# EAGLE board EEZ DIB DCM224 r3B3 (EAGLE 7.2.0), part 1 of 2
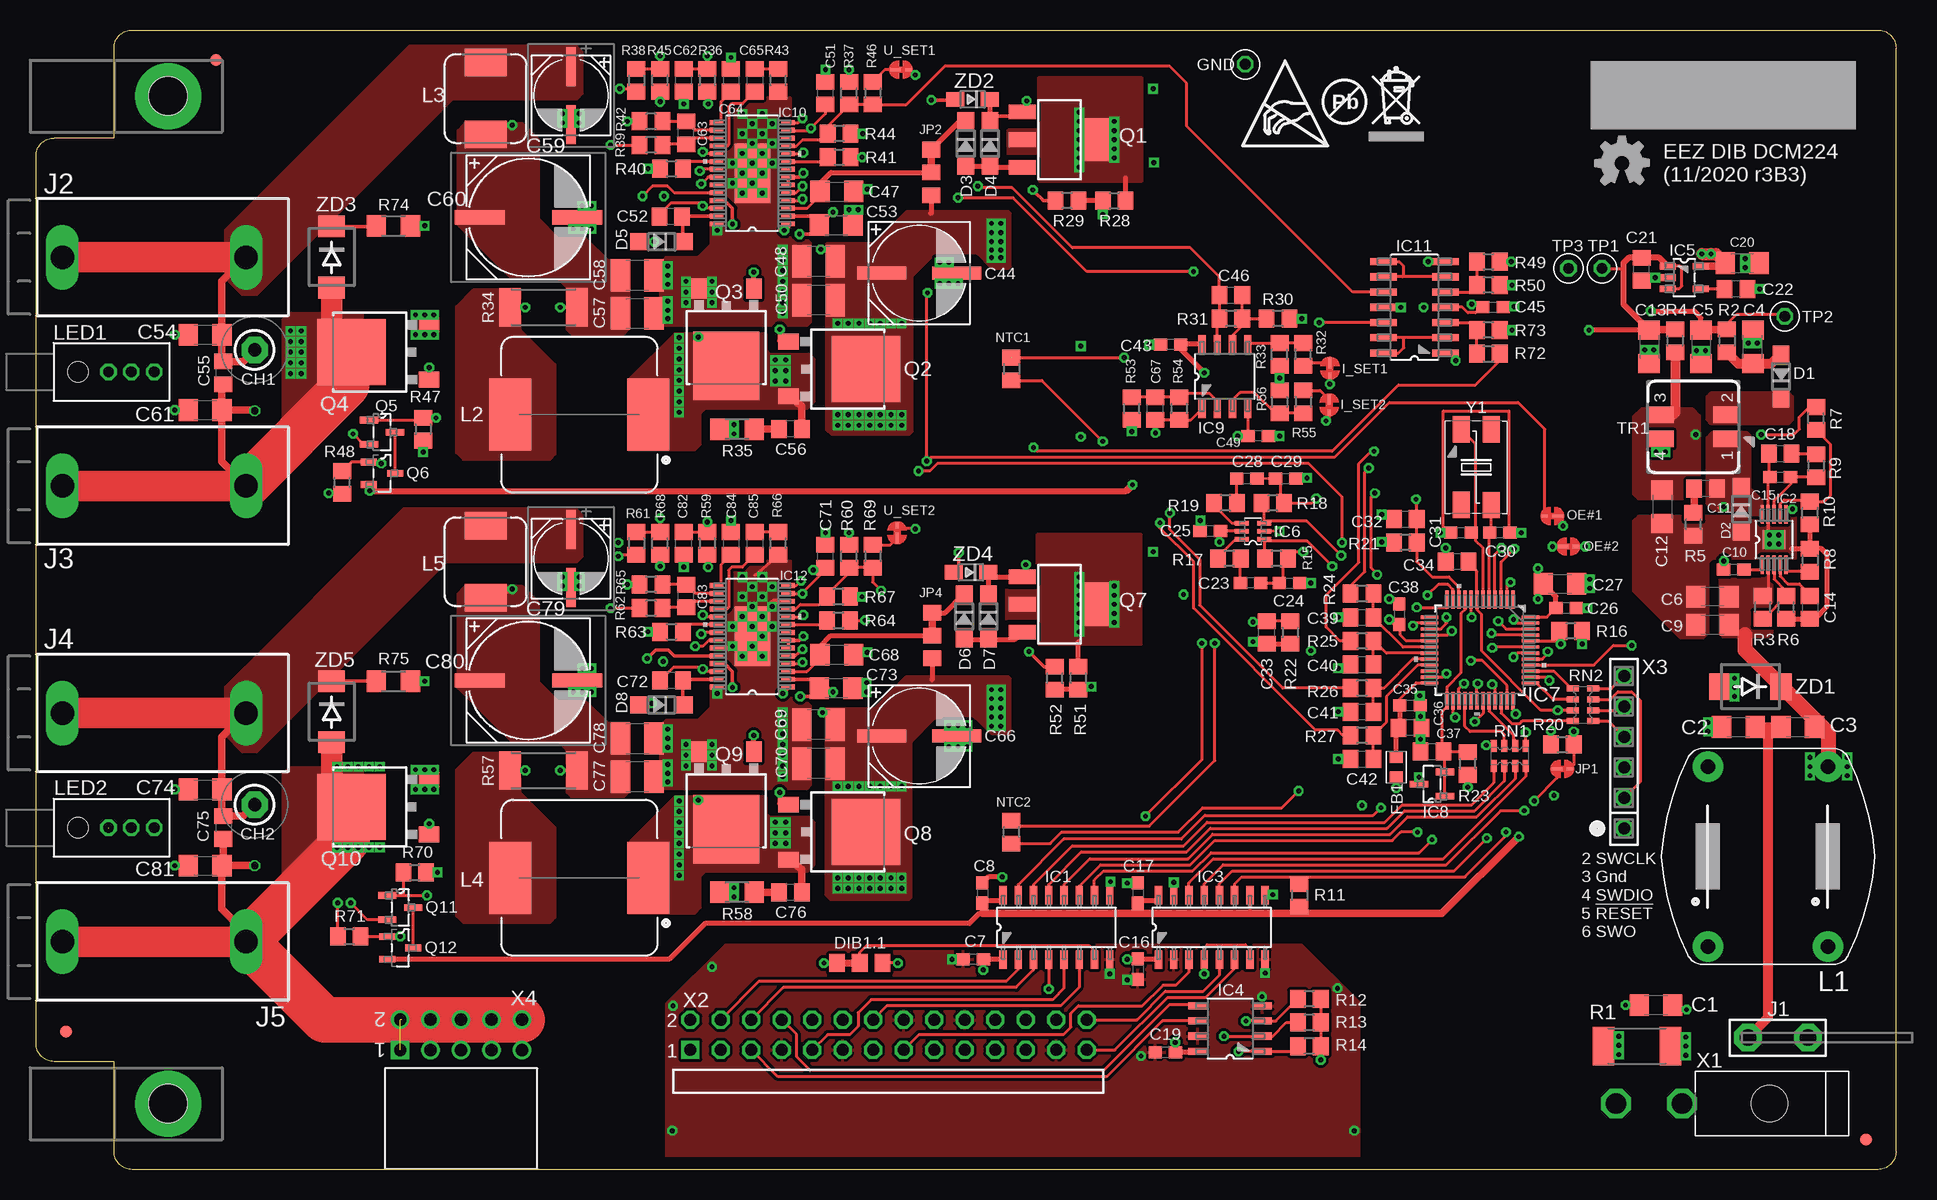
[diagram p4: board, top side]
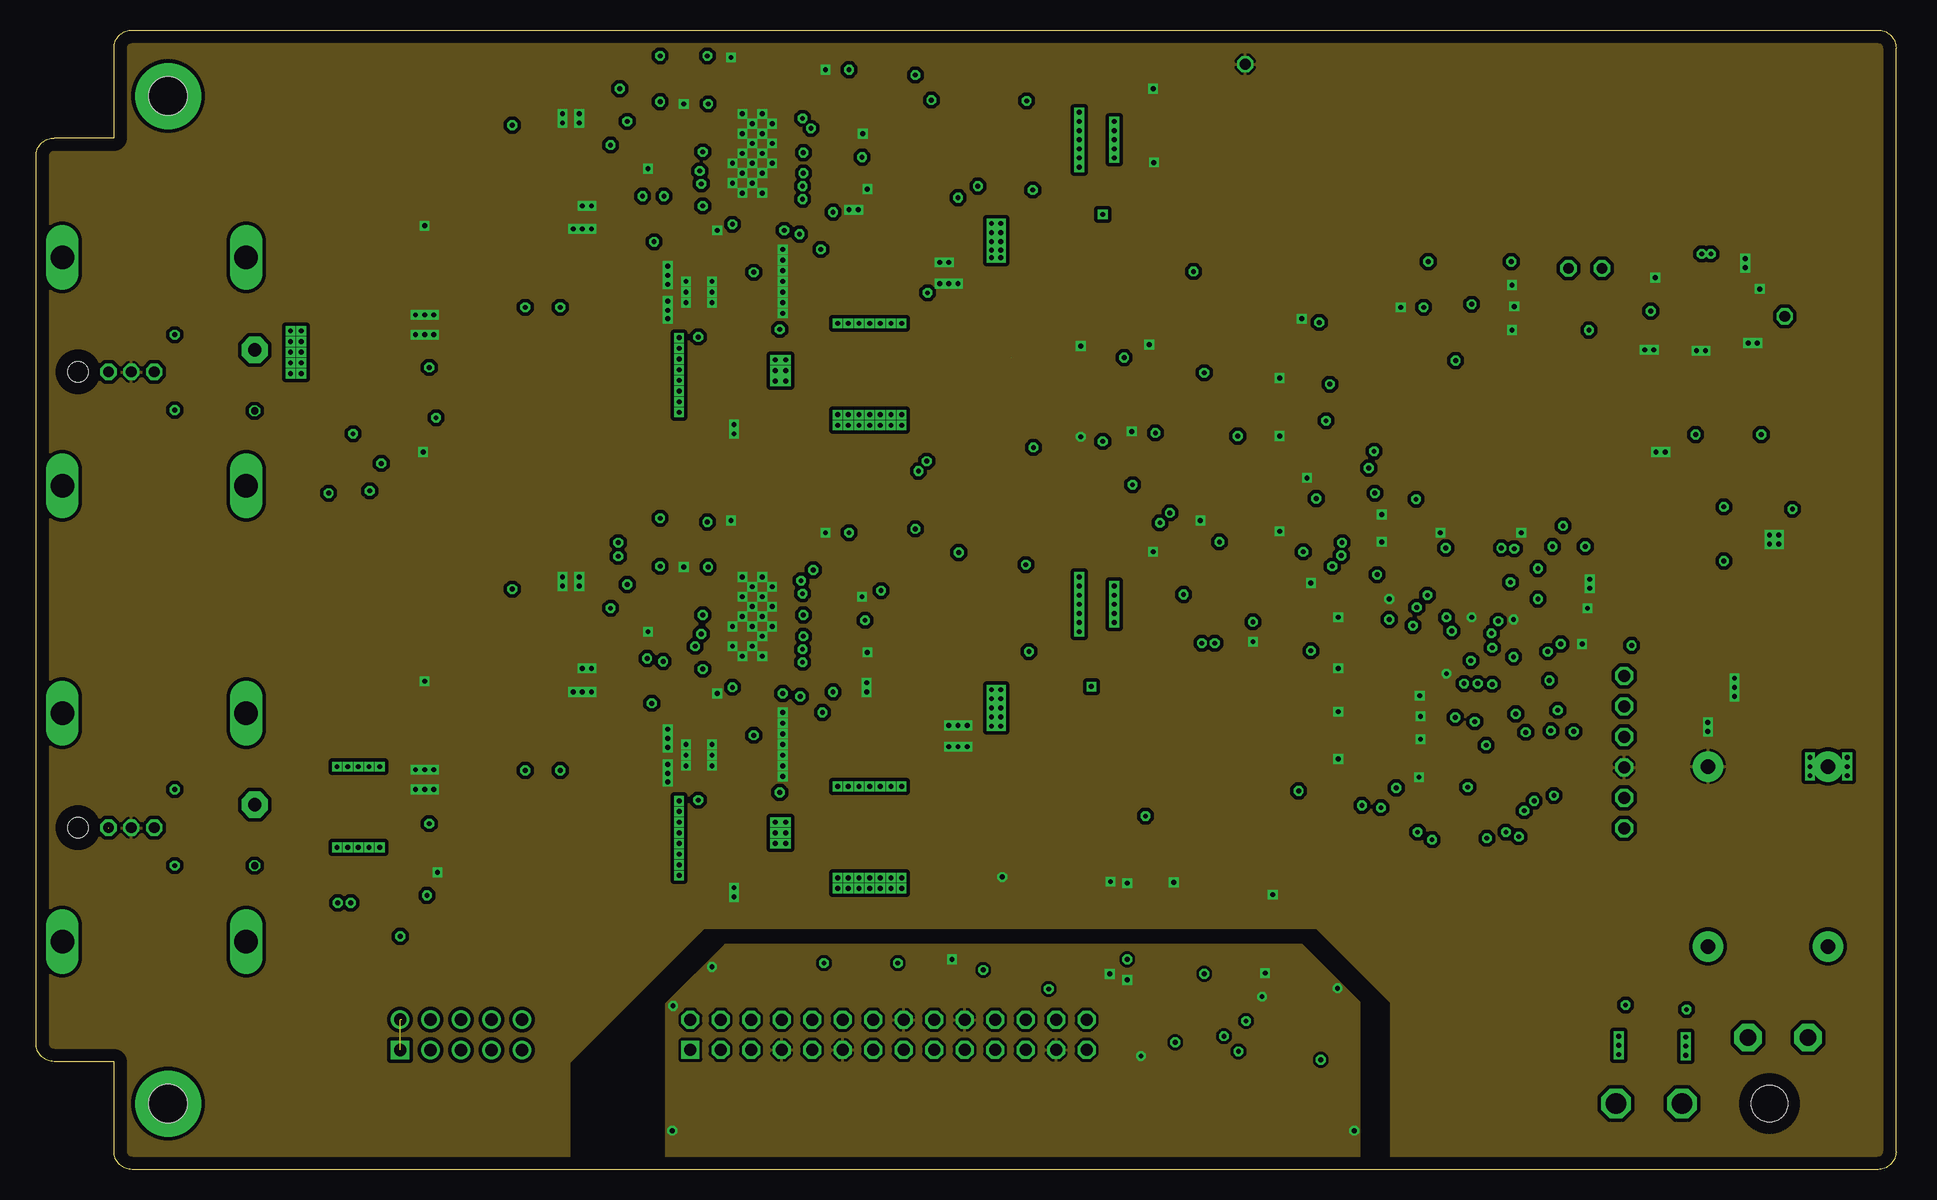
[diagram p5: board, inner layer L2]
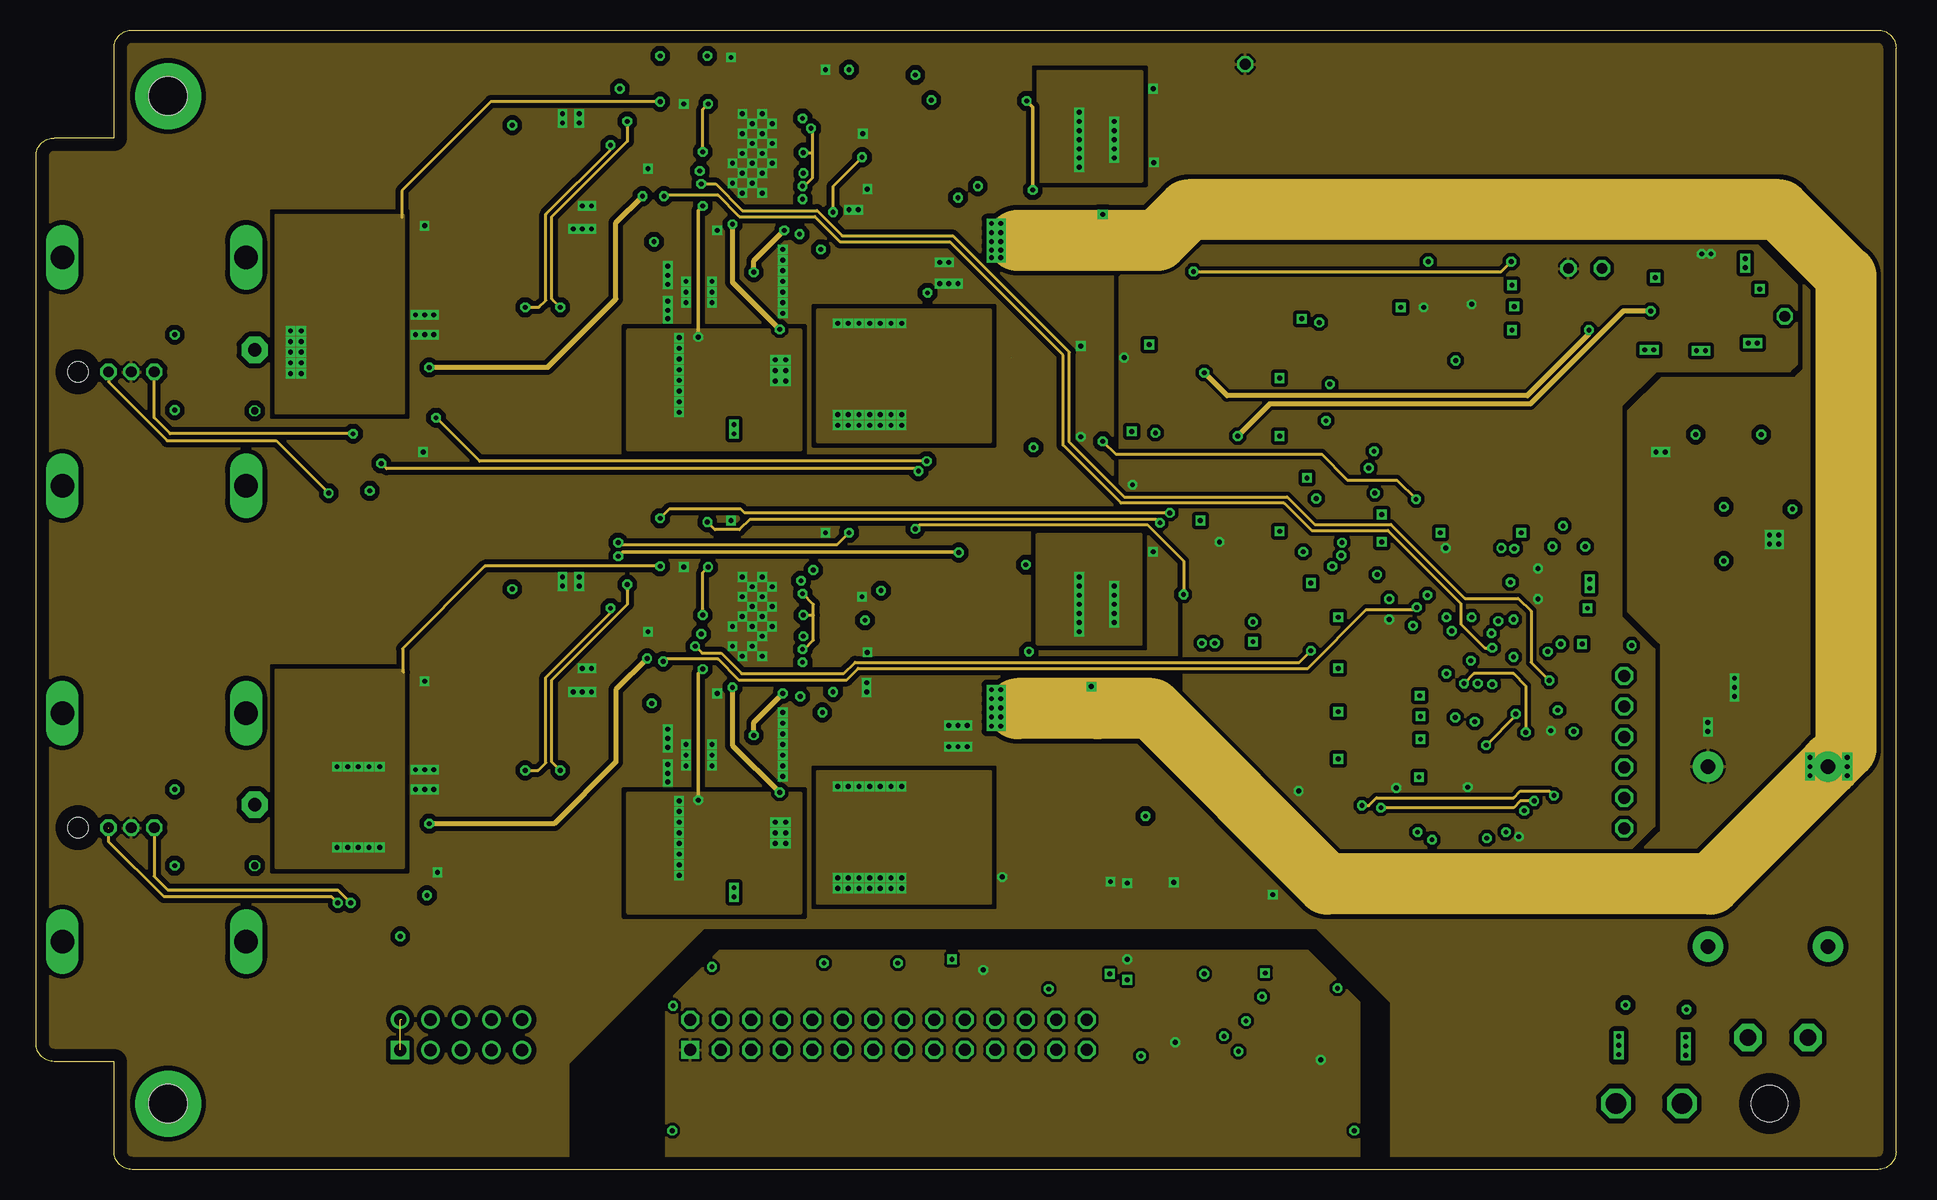
[diagram p6: board, inner layer L3]
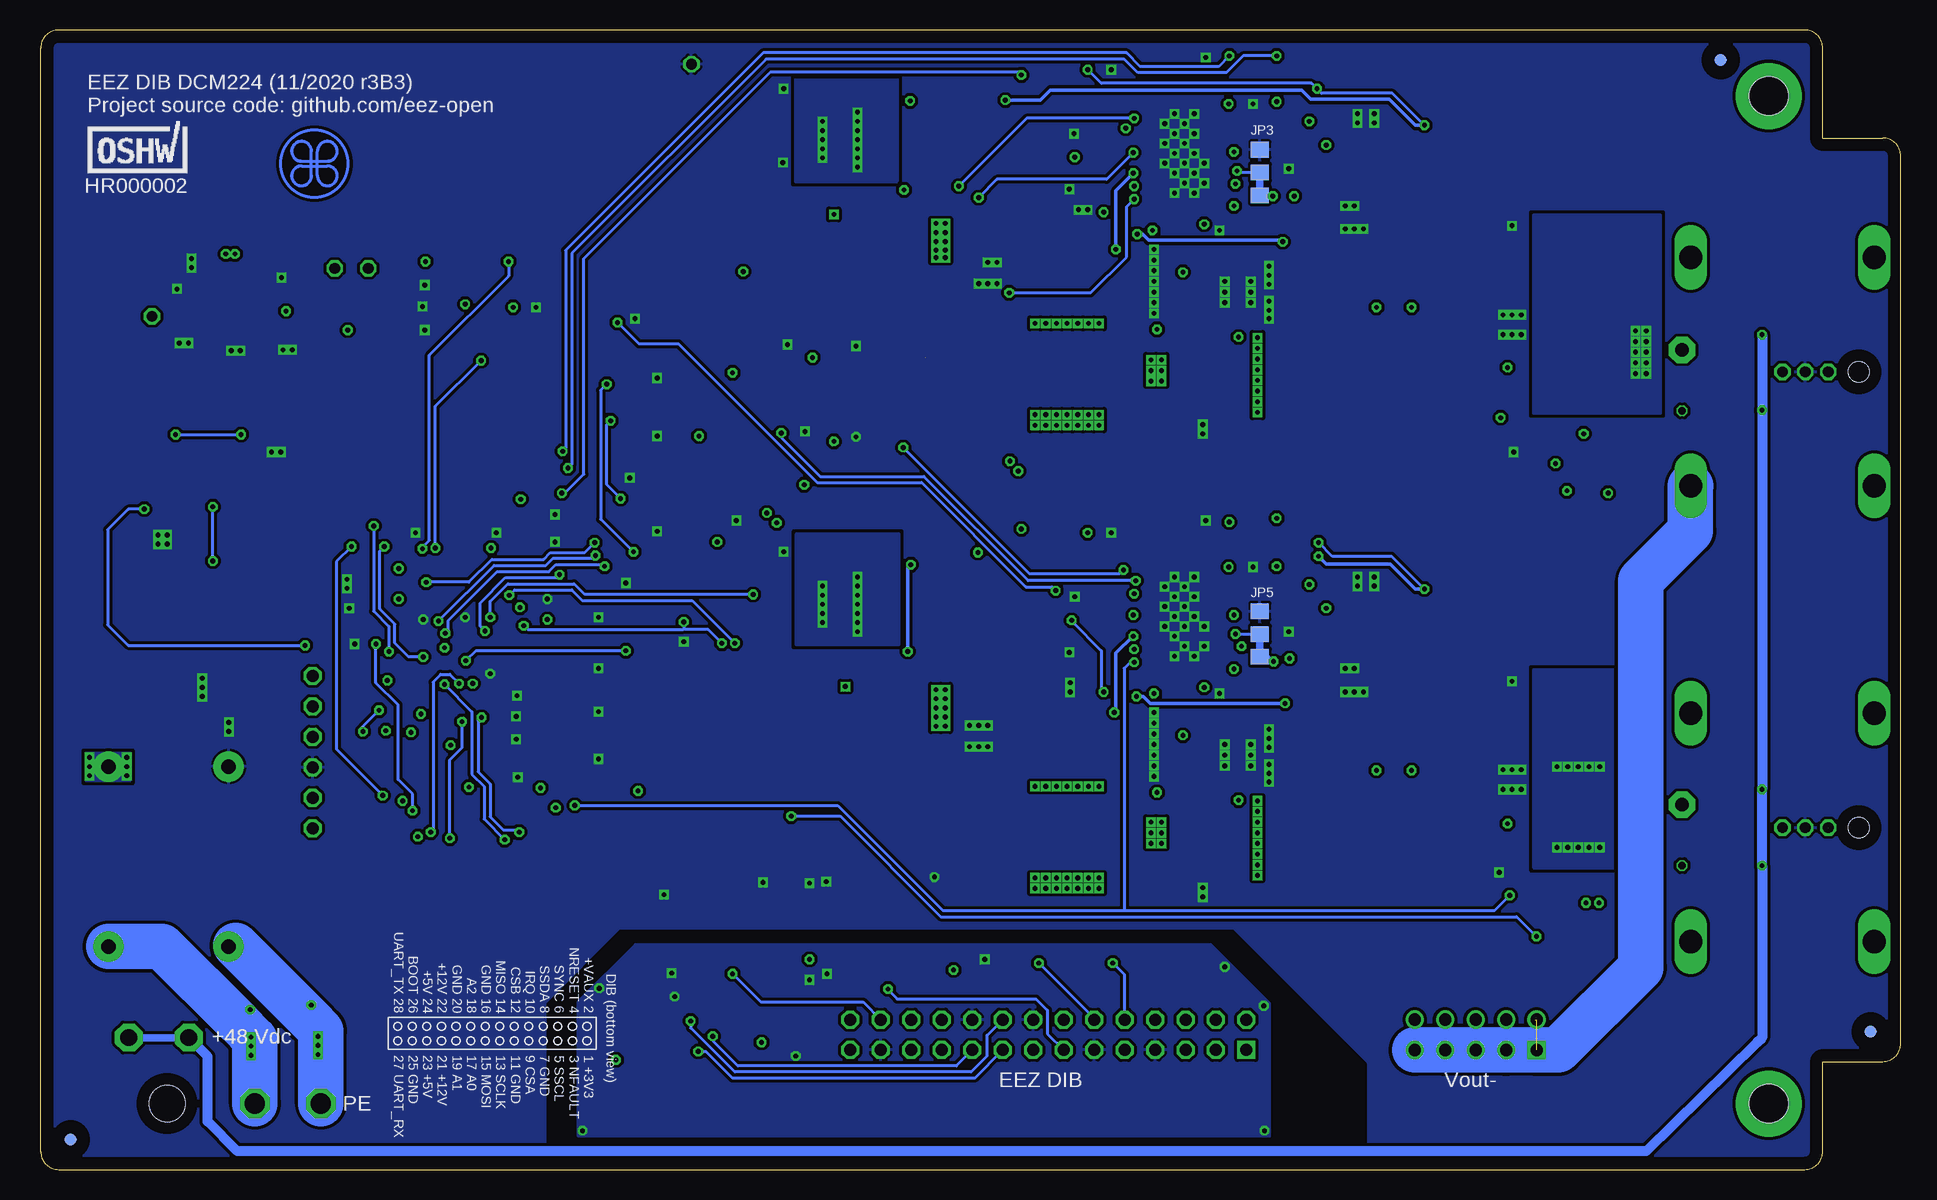
[diagram p7: board, bottom side, seen from below]

Size 155 x 95 mm. Coordinates in mm from the lower left corner, seen from the top.
Outline: 8,95 153.5,95 arc-90 155,93.5 155,1.5 arc-90 153.5,0 8,0 arc-90 6.5,1.5 6.5,9 1.5,9 arc-90 0,10.5 0,84.5 arc-90 1.5,86 6.5,86 6.5,93.5 arc-90 8,95
Copper layers (1+2+15+16): Top 0.035mm / dielectric 7mil / L2 0.03mm / dielectric 44mil / L3 0.03mm / dielectric 7mil / Bottom 0.035mm
Design rules "default *": minimum track width 6mil, minimum drill 0.3mm, track to track 6mil, track to pad 6mil, pad to pad 6mil, via to via 6mil, smd to smd 6mil, copper to edge 40mil, drill to drill 8mil, minimum pad ring 4mil, minimum via ring 8mil, stop-mask expansion 2.5mil, vias tented up to drill 1mm, thermal gap 8mil
Net classes: 0 default: width 0.203 mm, drill 0.3 mm, clearance 0.203 mm; 1 lvds: width 0.152 mm, drill 0.3 mm, clearance 0.152 mm to class 0, clearance 0.152 mm; 2 gnd: width 0.254 mm, drill 0.584 mm, clearance 0.254 mm
vRestrict: area 0,0 to 42,14; area 53,0 to 128,8.5

## Footprints (pad centres in the part's own frame; a part is rotated, then mirrored left to right if it is on the bottom)
C1206 = smd 1.6 x 1.8: 1 -1.4,0; 2 1.4,0
C0603 = smd 1.1 x 1: 1 -0.85,0; 2 0.85,0
C0805 = smd 1.3 x 1.5: 1 -0.95,0; 2 0.95,0
CAPAE830X1050N = smd 4.064 x 1.092: + -3.124,0; - 3.124,0
C1210 = smd 1.6 x 2.7: 1 -1.4,0; 2 1.4,0
CAPAE660X610N = smd 3.251 x 0.762: 1 -2.413,0; 2 2.413,0
CAPAE1030X1050N = smd 4.166 x 1.194: + -4.064,0; - 4.064,0
TP_1.1MM_2 = drill 0.6 octagon: GND 5.08,0 | drill 1.1 pad 2.184 octagon: TIP 0,0
SOD123 = smd 1.4 x 1.4: A 1.9,0; C -1.9,0
JP3-0805-CUT2 = smd 1.3 x 1.5: COM 0,0; NC 1.9,0; NO -1.9,0
BEAD0603 = smd 1 x 1.1: P$1 -0.85,0; P$2 0.85,0
FIDUCIAL_DUAL = smd 1.016 x 1.016 bottom: B 0,0 | smd 1.016 x 1.016: T 0,0
TEST-PIN_0.9MM = drill 0.9 octagon: 1 0,0
JP2-NOCUT = smd 0.889 x 0.254: 1 -0.445,0 | smd 0.508 x 0.254: 2 0.635,0
SOIC-16 = smd 1.549 x 0.61: 1 -2.692,4.445; 2 -2.692,3.175; 3 -2.692,1.905; 4 -2.692,0.635; 5 -2.692,-0.635; 6 -2.692,-1.905; 7 -2.692,-3.175; 8 -2.692,-4.445; 9 2.692,-4.445; 10 2.692,-3.175; 11 2.692,-1.905; 12 2.692,-0.635; 13 2.692,0.635; 14 2.692,1.905; 15 2.692,3.175; 16 2.692,4.445
SOP50P490X110-11N = smd 1.549 x 0.279: 1 -2.108,0.991; 2 -2.108,0.508; 3 -2.108,0; 4 -2.108,-0.508; 5 -2.108,-0.991; 6 2.108,-0.991; 7 2.108,-0.508; 8 2.108,0; 9 2.108,0.508; 10 2.108,0.991 | smd 1.575 x 1.88: TP 0,0
SOIC127P600X173-8N = smd 1.55 x 0.6: 1 -2.7,1.9; 2 -2.7,0.63; 3 -2.7,-0.64; 4 -2.7,-1.91; 5 2.7,-1.91; 6 2.7,-0.64; 7 2.7,0.63; 8 2.7,1.9
SOT95P270X145-5N = smd 1.321 x 0.559: 1 -1.372,0.94; 2 -1.372,0; 3 -1.372,-0.94; 4 1.372,-0.94; 5 1.372,0.94
SOT65P210X110-6N = smd 1.168 x 0.356: 1 -0.94,0.66; 2 -0.94,0; 3 -0.94,-0.66; 4 0.94,-0.66; 5 0.94,0; 6 0.94,0.66
LQFP-48 = smd 1.473 x 0.279: 1 -4.216,2.743; 2 -4.216,2.261; 3 -4.216,1.753; 4 -4.216,1.245; 5 -4.216,0.762; 6 -4.216,0.254; 7 -4.216,-0.254; 8 -4.216,-0.762; 9 -4.216,-1.245; 10 -4.216,-1.753; 11 -4.216,-2.261; 12 -4.216,-2.743; 25 4.216,-2.743; 26 4.216,-2.261; 27 4.216,-1.753; 28 4.216,-1.245; 29 4.216,-0.762; 30 4.216,-0.254; 31 4.216,0.254; 32 4.216,0.762; 33 4.216,1.245; 34 4.216,1.753; 35 4.216,2.261; 36 4.216,2.743 | smd 0.279 x 1.473: 13 -2.743,-4.216; 14 -2.261,-4.216; 15 -1.753,-4.216; 16 -1.245,-4.216; 17 -0.762,-4.216; 18 -0.254,-4.216; 19 0.254,-4.216; 20 0.762,-4.216; 21 1.245,-4.216; 22 1.753,-4.216; 23 2.261,-4.216; 24 2.743,-4.216; 37 2.743,4.216; 38 2.261,4.216; 39 1.753,4.216; 40 1.245,4.216; 41 0.762,4.216; 42 0.254,4.216; 43 -0.254,4.216; 44 -0.762,4.216; 45 -1.245,4.216; 46 -1.753,4.216; 47 -2.261,4.216; 48 -2.743,4.216
SOT103P240X110-3N = smd 1.524 x 0.559: 1 -1.079,1.016; 2 -1.079,-1.016; 3 1.079,0
LTC_05-08-1663-EB = smd 1.118 x 0.406: 1 -2.975,4.225; 2 -2.975,3.575; 3 -2.975,2.925; 4 -2.975,2.275; 5 -2.975,1.625; 6 -2.975,0.975; 7 -2.975,0.325; 8 -2.975,-0.325; 9 -2.975,-0.975; 10 -2.975,-1.625; 11 -2.975,-2.275; 12 -2.975,-2.925; 13 -2.975,-3.575; 14 -2.975,-4.225; 15 2.975,-4.225; 16 2.975,-3.575; 17 2.975,-2.925; 18 2.975,-2.275; 19 2.975,-1.625; 20 2.975,-0.975; 21 2.975,-0.325; 22 2.975,0.325; 23 2.975,0.975; 24 2.975,1.625; 25 2.975,2.275; 26 2.975,2.925; 27 2.975,3.575; 28 2.975,4.225 | smd 2.95 x 4.95: TP 0,0
SOIC127P600X175-14N = smd 2.2 x 0.6: 1 -2.591,3.81; 2 -2.591,2.54; 3 -2.591,1.27; 4 -2.591,0; 5 -2.591,-1.27; 6 -2.591,-2.54; 7 -2.591,-3.81; 8 2.591,-3.81; 9 2.591,-2.54; 10 2.591,-1.27; 11 2.591,0; 12 2.591,1.27; 13 2.591,2.54; 14 2.591,3.81
PCB_TAB-4907 = drill 1.4 pad 2.3 octagon: 1 -2.5,0; 2 2.5,0
DELTRON_571 = drill 1.94 long: 1 0,0; 1.1 15.3,0
PCB-MB = hole 3.2: 0,0
RN112 = drill 1.2 pad 2.54: 1 -7.5,5; 2 7.5,5; 3 -7.5,-5; 4 7.5,-5
125CDMCC/DS = smd 3.5 x 6: 1 -5.75,0; 2 5.75,0
COILCRAFT_HPI0630 = smd 2.3 x 3.5: 1 -3,0; 2 3,0
L-42WUM-1EGWT = drill 0.9 octagon: CC 4.445,0; GREEN 6.35,0; RED 2.54,0 | hole 1.7: 0,0
R_0805 = smd 1.3 x 1.5: 1 -0.95,0; 2 0.95,0
SOT223 = smd 1.219 x 2.235: 1 -2.311,-3.099; 2 0,-3.099; 3 2.311,-3.099 | smd 3.6 x 2.2: 4 0,3.099
TO252 = smd 1.3 x 1.7: 1 -2.285,-5.49; 2 2.285,-5.49 | smd 5.5 x 5.7: 3 0,0.95
SOT95P237X112-3N = smd 1.321 x 0.559: 1 -1.092,0.94; 2 -1.092,-0.94; 3 1.092,0
R2512 = smd 1.8 x 3.2: 1 -2.8,0; 2 2.8,0
R0805 = smd 1.3 x 1.5: 1 -0.95,0; 2 0.95,0
R_2512-4WIRE = smd 1.8 x 3.2: 1 -2.8,0; 2 2.8,0 | smd 1.27 x 0.254: 1S -2.413,0; 2S 2.413,0
R1206 = smd 1.6 x 1.803: 1 -1.422,0; 2 1.422,0
CAY16 = smd 0.5 x 1: 1 -1.35,-0.85; 2 -0.45,-0.85; 3 0.45,-0.85; 4 1.35,-0.85; 5 1.35,0.85; 6 0.45,0.85; 7 -0.45,0.85; 8 -1.35,0.85
SHORT_NOHOLE = smd 0.5 x 0.25 bottom: 1 0,0.117; 2 0,-0.117
SRF0703 = smd 1.4 x 2.1: 1 1,2.7; 2 -1,2.7; 3 -1,-2.7; 4 1,-2.7
MINIFIT_39301020 = drill 1.7 octagon: 1 0,0; 2 0,5.5 | hole 3: 0,-7.3
77317-104-28LF = drill 1 pad 1.5 square: 1 -33.02,-2.54 | drill 1 pad 1.5 octagon: 2 -33.02,0; 3 -30.48,-2.54; 4 -30.48,0; 5 -27.94,-2.54; 6 -27.94,0; 7 -25.4,-2.54; 8 -25.4,0; 9 -22.86,-2.54; 10 -22.86,0; 11 -20.32,-2.54; 12 -20.32,0; 13 -17.78,-2.54; 14 -17.78,0; 15 -15.24,-2.54; 16 -15.24,0; 17 -12.7,-2.54; 18 -12.7,0; 19 -10.16,-2.54; 20 -10.16,0; 21 -7.62,-2.54; 22 -7.62,0; 23 -5.08,-2.54; 24 -5.08,0; 25 -2.54,-2.54; 26 -2.54,0; 27 0,-2.54; 28 0,0
SSW-106-02-S-S = drill 1 pad 1.5 octagon: 1 -6.35,0; 2 -3.81,0; 3 -1.27,0; 4 1.27,0; 5 3.81,0; 6 6.35,0
SSW-105-02-T-D-RA = drill 1.016 square: 1 10.16,2.54 | drill 1.016: 2 10.16,0; 3 7.62,2.54; 4 7.62,0; 5 5.08,2.54; 6 5.08,0; 7 2.54,2.54; 8 2.54,0; 9 0,2.54; 10 0,0
12SMX(B) = smd 2.2 x 1.4: 1 -3.15,-1.25; 2 3.14,-1.25; 3 3.15,1.25; 4 -3.15,1.25
DO214AA = smd 1.8 x 2.2: A 2.55,0; C -2.55,0
SOD323-W = smd 1.5 x 1.2: A 1.45,0; C -1.45,0

## Placement (x,y rotation side)
C1  1u/100V  [C1206]  135,13.72 0 top
C2  10n/200V  [C1206]  141.86,36.89 0 top
C3  10n/200V  [C1206]  146.81,36.89 0 top
C4  4u7  [C1206]  143.07,68.58 90 top
C5  4u7  [C1206]  138.75,68.58 270 top
C6  2u2  [C1206]  139.7,47.75 180 top
C7  100n  [C0603]  78.11,17.53 180 top
C8  100n  [C0603]  78.87,23.05 270 top
C9  2u2  [C1206]  139.7,45.4 180 top
C10  100n  [C0603]  141.48,50.04 0 top
C11  330p  [C0805]  139.13,56.77 180 top
C12  22u  [C1206]  135.51,55.24 270 top
C13  4u7  [C1206]  134.43,68.58 270 top
C14  10n  [C0805]  147.83,46.86 270 top
C15  33p  [C0603]  145.35,57.72 0 top
C16  100n  [C0603]  91.82,16.7 270 top
C17  100n  [C0603]  91.82,23.05 270 top
C18  10n  [C0805]  145.35,59.69 0 top
C19  100n  [C0603]  94.11,9.78 0 top
C20  2u2  [C1206]  142.18,75.56 0 top
C21  N.C.  [C0805]  133.79,75.06 90 top
C22  10n  [C0805]  141.67,73.41 180 top
C23  100n  [C0603]  101.22,48.9 180 top
C24  100n  [C0603]  104.46,48.9 0 top
C25  100n  [C0603]  97.85,53.21 180 top
C26  100n  [C0603]  127.51,46.8 180 top
C27  4u7  [C1206]  127,48.83 0 top
C28  100n  [C0603]  100.9,57.59 180 top
C29  100n  [C0603]  104.14,57.59 0 top
C30  4p7  [C0603]  121.98,53.09 180 top
C31  4p7  [C0603]  118.75,53.09 0 top
C32  10n  [C0805]  114.11,54.23 0 top
C33  10n  [C0805]  102.55,44.77 90 top
C34  1n  [C0805]  118.43,50.67 180 top
C35  100n  [C0603]  114.49,38.67 180 top
C36  1u  [C0805]  114.49,36.83 180 top
C37  4n7  [C0805]  116.33,34.86 0 top
C38  100n  [C0603]  113.6,46.29 270 top
C39  4n7  [C0805]  110.49,46.04 0 top
C40  4n7  [C0805]  110.49,42.1 0 top
C41  4n7  [C0805]  110.49,38.16 0 top
C42  4n7  [C0805]  110.49,34.23 0 top
C43  100n  [C0603]  94.55,68.77 180 top
C44  EEEFK1H470  [CAPAE830X1050N]  73.6,74.74 0 top
C45  100n  [C0603]  121.41,71.88 0 top
C46  100p  [C0805]  99.57,72.9 0 top
C47  4u7  [C1206]  66.74,81.53 0 top
C48  10u  [C1210]  65.21,75.69 180 top
C49  100n  [C0603]  101.85,61.15 180 top
C50  10u  [C1210]  65.21,72.45 180 top
C51  1u  [C0805]  65.79,89.73 90 top
C52  220n  [C0805]  52.9,79.44 180 top
C53  22u  [C1206]  66.67,78.74 0 top
C54  10n/200V  [C1206]  14.1,69.6 0 top
C55  1u  [C0805]  15.62,66.42 270 top
C56  680p  [C0805]  62.87,61.72 180 top
C57  22u  [C1210]  50.1,71.37 0 top
C58  22u  [C1210]  50.1,74.55 0 top
C59  EEEFK1V470P  [CAPAE660X610N]  44.58,89.53 270 top
C60  EEEFK1J101P  [CAPAE1030X1050N]  41.02,79.38 0 top
C61  10n/200V  [C1206]  14.1,63.31 0 top
C62  470p  [C0805]  53.98,90.81 90 top
C63  33n  [C0805]  54.17,86.42 90 top
C64  10n  [C0805]  57.91,90.81 270 top
C65  4n7  [C0805]  59.88,90.81 270 top
C66  EEEFK1H470  [CAPAE830X1050N]  73.6,36.13 0 top
C67  100p  [C0805]  93.28,63.44 90 top
C68  4u7  [C1206]  66.74,42.93 0 top
C69  10u  [C1210]  65.21,37.08 180 top
C70  10u  [C1210]  65.21,33.85 180 top
C71  1u  [C0805]  65.79,51.12 90 top
C72  220n  [C0805]  52.96,40.77 180 top
C73  22u  [C1206]  66.67,40.13 0 top
C74  10n/200V  [C1206]  14.1,31.69 0 top
C75  1u  [C0805]  15.62,28.51 270 top
C76  680p  [C0805]  62.87,23.11 180 top
C77  22u  [C1210]  50.1,32.77 0 top
C78  22u  [C1210]  50.1,35.94 0 top
C79  EEEFK1V470P  [CAPAE660X610N]  44.58,50.93 270 top
C80  EEEFK1J101P  [CAPAE1030X1050N]  41.02,40.77 0 top
C81  10n/200V  [C1206]  14.1,25.34 0 top
C82  470p  [C0805]  53.98,52.2 90 top
C83  33n  [C0805]  54.17,47.82 90 top
C84  10n  [C0805]  57.91,52.2 270 top
C85  4n7  [C0805]  59.88,52.2 270 top
CH1  [TP_1.1MM_2]  18.22,68.33 270 top
CH2  [TP_1.1MM_2]  18.22,30.42 270 top
D1  SKL16  [SOD123]  145.41,66.1 90 top
D2  SKL16  [SOD123]  142.11,55.05 270 top
D3  SKL16  [SOD123]  77.47,85.53 270 top
D4  SKL16  [SOD123]  79.5,85.53 270 top
D5  SKL16  [SOD123]  52.13,77.34 180 top
D6  SKL16  [SOD123]  77.34,46.1 270 top
D7  SKL16  [SOD123]  79.38,46.1 270 top
D8  SKL16  [SOD123]  52.13,38.73 180 top
DIB1.1  JP3-CUT-0805-ROTATED  [JP3-0805-CUT2]  68.64,17.21 180 top
EEZ_SIGNATURE  SIGNATURESMALL  [SIGNATURE_5MM]  132.19,83.86 180 top
FB1  60R@100MHz  [BEAD0603]  113.35,33.53 90 top
FM1  FIDUCIAL_2  [FIDUCIAL_DUAL]  15,92.5 0 top
FM2  FIDUCIAL_2  [FIDUCIAL_DUAL]  152.5,2.5 0 top
FM3  FIDUCIAL_2  [FIDUCIAL_DUAL]  2.5,11.5 0 top
GND  [TEST-PIN_0.9MM]  100.77,92.14 0 top
I_SET1  JP2-NOCUT  [JP2-NOCUT]  107.82,66.8 270 top
I_SET2  JP2-NOCUT  [JP2-NOCUT]  107.76,63.75 270 top
IC1  Si8662AB-B-IS1  [SOIC-16]  85.03,20.19 90 top
IC2  TPS54060DGQ  [SOP50P490X110-11N]  144.84,52.51 90 top
IC3  Si8641AB-B-IS1  [SOIC-16]  97.98,20.19 90 top
IC4  M24C32-WMN6P  [SOIC127P600X173-8N]  99.5,11.75 180 top
IC5  LP2985-33DBVR  [SOT95P270X145-5N]  137.35,74.36 0 top
IC6  74HC2G04GW,125  [SOT65P210X110-6N]  101.41,53.21 180 top
IC7  STM32F373C8T6  [LQFP-48]  120.33,43.31 270 top
IC8  TL431B  [SOT103P240X110-3N]  116.33,32.13 180 top
IC9  MC33272ADR2G  [SOIC127P600X173-8N]  99.06,66.1 90 top
IC10  LT3763EFE#PBF  [LTC_05-08-1663-EB]  59.69,83.06 180 top
IC11  MC33274ADR2G  [SOIC127P600X175-14N]  114.87,71.88 180 top
IC12  LT3763EFE#PBF  [LTC_05-08-1663-EB]  59.69,44.45 180 top
J1  4907  [PCB_TAB-4907]  145.16,11 180 top
J2  571-0500  [DELTRON_571]  17.5,76.05 180 top
J3  571-0100  [DELTRON_571]  17.5,57 180 top
J4  571-0500  [DELTRON_571]  17.5,38.05 180 top
J5  571-0100  [DELTRON_571]  17.5,19 180 top
JP1  JP2-NOCUT  [JP2-NOCUT]  127.19,33.4 0 top
JP2  JP3-CUT-0805-ROTATED  [JP3-0805-CUT2]  74.61,83.12 90 top
JP3  JP3-CUT-0805-ROTATED  [JP3-0805-CUT2]  53.4,83.12 270 bottom
JP4  JP3-CUT-0805-ROTATED  [JP3-0805-CUT2]  74.68,44.51 90 top
JP5  JP3-CUT-0805-ROTATED  [JP3-0805-CUT2]  53.4,44.64 270 bottom
KK1  PMB-1  [PCB-MB]  11,89.5 0 top
KK2  PMB-1  [PCB-MB]  11,5.5 0 top
L1  RN112-4-02-0M7  [RN112]  144.34,26.1 90 top
L2  125CDMCCDS-330MC  [125CDMCC/DS]  45.28,62.93 180 top
L3  HPI0630-3R3  [COILCRAFT_HPI0630]  37.47,89.28 90 top
L4  125CDMCCDS-330MC  [125CDMCC/DS]  45.28,24.32 180 top
L5  HPI0630-3R3  [COILCRAFT_HPI0630]  37.47,50.67 90 top
LED1  WP42WUM/EGW  [L-42WUM-1EGWT]  3.5,66.5 0 top
LED2  WP42WUM/EGW  [L-42WUM-1EGWT]  3.5,28.5 0 top
NTC1  NTCS0805E3103JMT  [R_0805]  81.28,66.74 270 top
NTC2  NTCS0805E3103JMT  [R_0805]  81.28,28.13 90 top
OE#1  JP2-NOCUT  [JP2-NOCUT]  126.36,54.48 180 top
OE#2  JP2-NOCUT  [JP2-NOCUT]  127.7,51.94 0 top
Q1  BSP716NH6327XTSA1  [SOT223]  85.28,85.85 270 top
Q2  NTD5867NLT4G  [TO252]  68.2,66.74 270 top
Q3  NTD5867NLT4G  [TO252]  57.53,67.94 180 top
Q4  NTD5867NLT4G  [TO252]  27.24,68.14 90 top
Q5  BSS205NH6327XTSA1  [SOT103P240X110-3N]  28.83,61.47 0 top
Q6  BSS84  [SOT95P237X112-3N]  28.83,58.04 0 top
Q7  BSP716NH6327XTSA1  [SOT223]  85.28,47.12 270 top
Q8  NTD5867NLT4G  [TO252]  68.2,28.13 270 top
Q9  NTD5867NLT4G  [TO252]  57.53,29.34 180 top
Q10  NTD5867NLT4G  [TO252]  27.24,30.23 90 top
Q11  BSS205NH6327XTSA1  [SOT103P240X110-3N]  30.35,21.84 0 top
Q12  BSS84  [SOT95P237X112-3N]  30.35,18.48 0 top
R1  N.C.  [R2512]  133.41,10.29 0 top
R2  10R  [R0805]  140.91,69.09 270 top
R3  47K  [R0805]  143.89,46.86 90 top
R4  10R  [R0805]  136.59,69.09 270 top
R5  10R  [R0805]  138.11,53.78 90 top
R6  2K2  [R0805]  145.86,46.86 90 top
R7  86K6  [R0805]  148.34,62.61 90 top
R8  330K  [R0805]  147.83,50.8 270 top
R9  86K6  [R0805]  148.34,58.67 270 top
R10  10K  [R0805]  147.83,54.74 90 top
R11  10K  [R0805]  105.28,22.86 270 top
R12  10K  [R0805]  106.11,14.22 180 top
R13  10K  [R0805]  106.11,12.26 180 top
R14  10K  [R0805]  106.11,10.29 180 top
R15  10K  [R0805]  103.38,50.93 180 top
R16  10K  [R0805]  127.89,44.89 180 top
R17  10K  [R0805]  99.44,50.93 180 top
R18  10K  [R0805]  103.06,55.56 180 top
R19  10K  [R0805]  99.12,55.56 180 top
R20  10K  [R0805]  127.19,35.43 0 top
R21  3K3  [R0805]  114.11,52.26 180 top
R22  3K3  [R0805]  104.52,44.77 270 top
R23  120R  [R0805]  119.32,33.85 90 top
R24  2K2  [R0805]  110.49,48.01 180 top
R25  2K2  [R0805]  110.49,44.07 180 top
R26  2K2  [R0805]  110.49,40.13 180 top
R27  2K2  [R0805]  110.49,36.2 180 top
R28  10R  [R0805]  89.85,80.77 0 top
R29  86K6  [R0805]  85.92,80.77 180 top
R30  20K  [R0805]  103.5,70.93 180 top
R31  12K  [R0805]  99.57,70.93 180 top
R32  20K  [R0805]  105.6,67.94 90 top
R33  12K  [R0805]  103.63,67.94 90 top
R34  R010/2W  [R_2512-4WIRE]  42.29,71.88 0 top
R35  22R  [R1206]  58.42,61.72 0 top
R36  2K2  [R0805]  55.94,90.81 270 top
R37  36K  [R0805]  67.75,89.73 90 top
R38  68K  [R0805]  50.04,90.81 270 top
R39  10R  [R0805]  51.24,85.41 180 top
R40  150K  [R0805]  52.96,83.44 0 top
R41  47K  [R0805]  66.93,84.39 0 top
R42  10R  [R0805]  51.24,87.38 180 top
R43  86K6  [R0805]  61.85,90.81 90 top
R44  3K6  [R0805]  66.93,86.36 180 top
R45  7K5  [R0805]  52.01,90.81 90 top
R46  3K3  [R0805]  69.72,89.73 270 top
R47  47K  [R0805]  32.26,61.72 270 top
R48  120R  [R0805]  25.53,57.28 90 top
R49  11K8  [R0805]  121.03,75.69 0 top
R50  15K  [R0805]  121.03,73.72 180 top
R51  10R  [R0805]  86.87,40.96 90 top
R52  86K6  [R0805]  84.9,40.96 90 top
R53  20K  [R0805]  91.31,63.44 90 top
R54  12K  [R0805]  95.25,63.44 270 top
R55  20K  [R0805]  105.6,64.01 270 top
R56  12K  [R0805]  103.63,64.01 270 top
R57  R010/2W  [R_2512-4WIRE]  42.29,33.27 0 top
R58  22R  [R1206]  58.42,23.11 0 top
R59  2K2  [R0805]  55.94,52.2 270 top
R60  36K  [R0805]  67.75,51.12 90 top
R61  68K  [R0805]  50.04,52.2 270 top
R62  10R  [R0805]  51.24,46.8 180 top
R63  150K  [R0805]  52.96,44.83 0 top
R64  47K  [R0805]  66.87,45.78 0 top
R65  10R  [R0805]  51.24,48.77 180 top
R66  86K6  [R0805]  61.85,52.2 90 top
R67  3K6  [R0805]  66.87,47.75 180 top
R68  7K5  [R0805]  52.01,52.2 90 top
R69  3K3  [R0805]  69.72,51.12 270 top
R70  47K  [R0805]  31.56,24.77 0 top
R71  120R  [R0805]  26.1,19.43 0 top
R72  11K8  [R0805]  121.03,68.01 0 top
R73  15K  [R0805]  121.03,69.98 180 top
R74  3K3/0.25W  [R1206]  29.78,78.68 180 top
R75  3K3/0.25W  [R1206]  29.78,40.7 180 top
RN1  DR1206-33R-4/8  [CAY16]  122.81,34.48 0 top
RN2  N.C.  [CAY16]  128.91,38.73 270 top
SH1  [SHORT_NOHOLE]  30.23,9.96 90 top
SH2  [SHORT_NOHOLE]  30.35,12.5 270 bottom
TP1  [TEST-PIN_0.9MM]  130.49,75.12 0 top
TP2  [TEST-PIN_0.9MM]  145.73,71.12 0 top
TP3  [TEST-PIN_0.9MM]  127.7,75.12 0 top
TR1  SRF0703-821M  [SRF0703]  138.11,61.91 270 top
U$1  HR000002  [CERT-SMALL-SILK]  146.94,83.06 0 bottom
U$2  [RECYCLE_BIN1/8]  111.05,85.75 0 top
U$4  [ESD_SYMBOL]  100.54,85.34 0 top
U$7  [PB_SMALL]  109.03,89.03 0 top
U_SET1  JP2-NOCUT  [JP2-NOCUT]  72.07,91.69 0 top
U_SET2  JP2-NOCUT  [JP2-NOCUT]  71.75,53.09 90 top
X1  39-30-1020  [MINIFIT_39301020]  137.16,5.5 90 top
X2  77317-104-28LF  [77317-104-28LF]  87.54,12.5 0 top
X3  N.C.  [SSW-106-02-S-S]  132.33,34.8 90 top
X4  DS1024-2*5R0  [SSW-105-02-T-D-RA]  40.5,12.5 180 top
Y1  LF XTAL026392  [12SMX(B)]  120.02,58.55 270 top
ZD1  SMAJ51A  [DO214AA]  142.88,40.26 180 top
ZD2  MM3Z9V1T1G  [SOD323-W]  78.04,89.22 180 top
ZD3  SMAJ51A  [DO214AA]  24.64,76.07 270 top
ZD4  MM3Z9V1T1G  [SOD323-W]  77.91,49.78 180 top
ZD5  SMAJ51A  [DO214AA]  24.64,38.16 270 top